# Altium schematic sheet alimentation.SchDoc: Alimentation
size A4; Date: 26.04.2023; Revision: 1; SheetNumber: 1; SheetTotal: 1
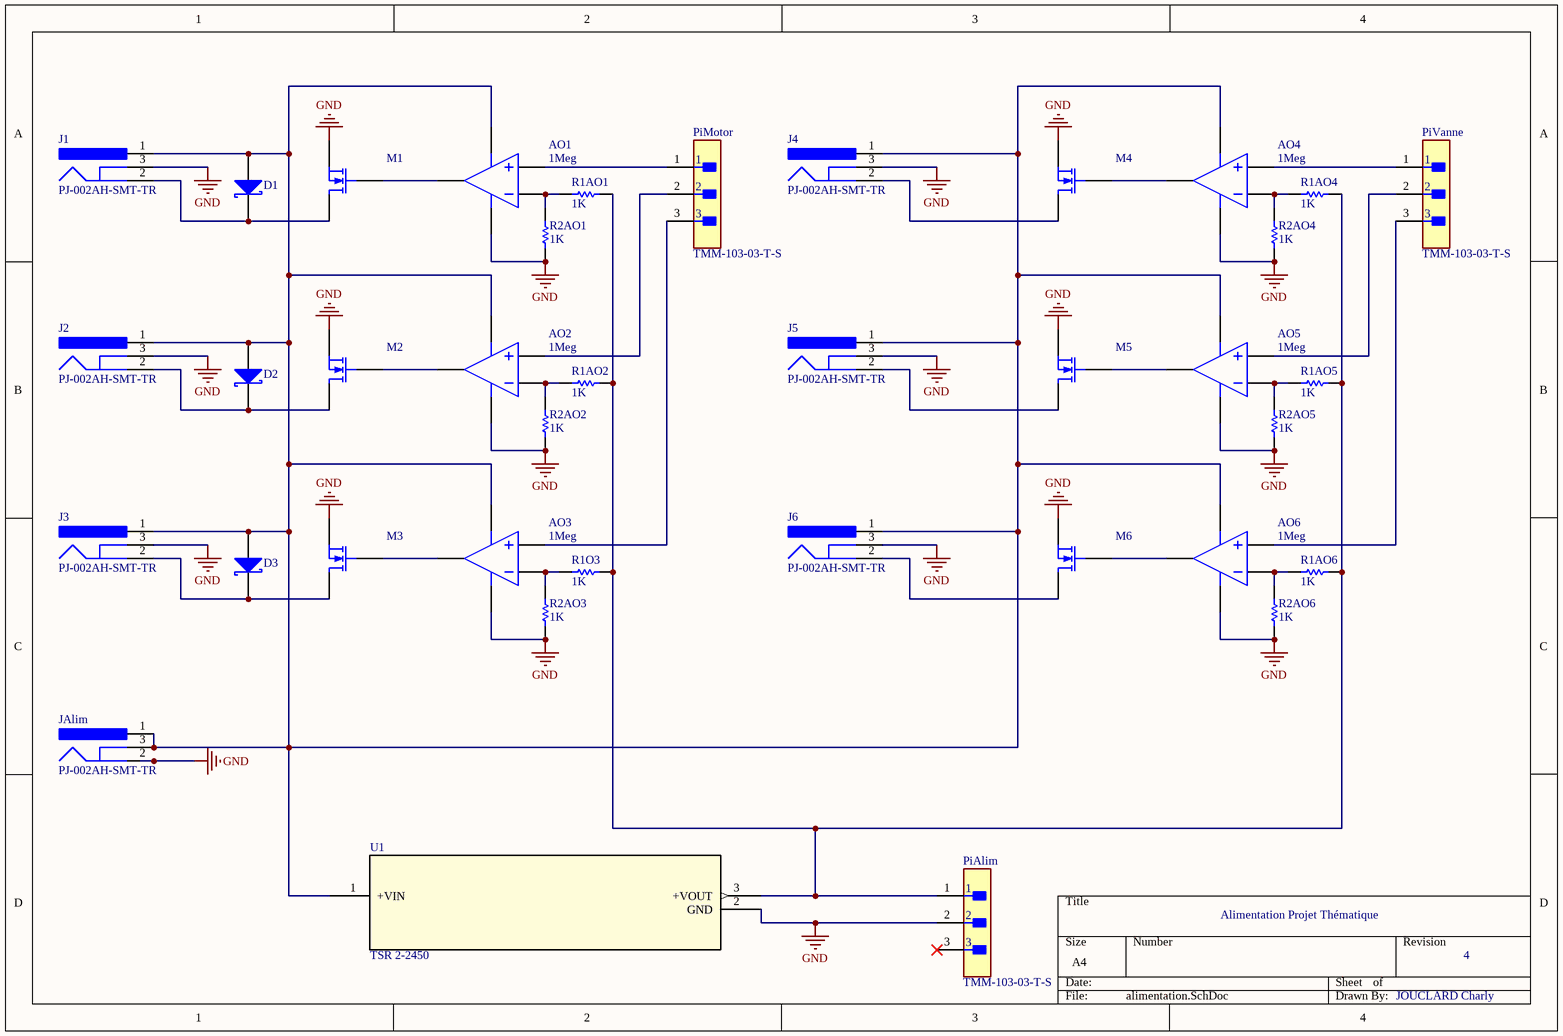
[diagram p0: alimentation.SchDoc]

## Parts
AO1  GAIN: 1Meg  (hidden comment: Ideal Operational Amplifier)
AO2  GAIN: 1Meg  (hidden comment: Ideal Operational Amplifier)
AO3  GAIN: 1Meg  (hidden comment: Ideal Operational Amplifier)
AO4  GAIN: 1Meg  (hidden comment: Ideal Operational Amplifier)
AO5  GAIN: 1Meg  (hidden comment: Ideal Operational Amplifier)
AO6  GAIN: 1Meg  (hidden comment: Ideal Operational Amplifier)
D1  Shottky Diode  (value not drawn)
D2  Shottky Diode  (value not drawn)
D3  Shottky Diode  (value not drawn)
J1  PJ-002AH-SMT-TR  [CUI-PJ-002AH-4_V]
J2  PJ-002AH-SMT-TR  [CUI-PJ-002AH-4_V]
J3  PJ-002AH-SMT-TR  [CUI-PJ-002AH-4_V]
J4  PJ-002AH-SMT-TR  [CUI-PJ-002AH-4_V]
J5  PJ-002AH-SMT-TR  [CUI-PJ-002AH-4_V]
J6  PJ-002AH-SMT-TR  [CUI-PJ-002AH-4_V]
JAlim  PJ-002AH-SMT-TR  [CUI-PJ-002AH-4_V]
M1  N-chanel Power MOSFET VDMOS Model  (value not drawn)
M2  N-chanel Power MOSFET VDMOS Model  (value not drawn)
M3  N-chanel Power MOSFET VDMOS Model  (value not drawn)
M4  N-chanel Power MOSFET VDMOS Model  (value not drawn)
M5  N-chanel Power MOSFET VDMOS Model  (value not drawn)
M6  N-chanel Power MOSFET VDMOS Model  (value not drawn)
PiAlim  TMM-103-03-T-S  [FP-TMM-103-03-T-S-MFG]
PiMotor  TMM-103-03-T-S  [FP-TMM-103-03-T-S-MFG]
PiVanne  TMM-103-03-T-S  [FP-TMM-103-03-T-S-MFG]
R1AO1  value 1K  (hidden comment: Resistor)
R1AO2  value 1K  (hidden comment: Resistor)
R1AO4  value 1K  (hidden comment: Resistor)
R1AO5  value 1K  (hidden comment: Resistor)
R1AO6  value 1K  (hidden comment: Resistor)
R1O3  value 1K  (hidden comment: Resistor)
R2AO1  value 1K  (hidden comment: Resistor)
R2AO2  value 1K  (hidden comment: Resistor)
R2AO3  value 1K  (hidden comment: Resistor)
R2AO4  value 1K  (hidden comment: Resistor)
R2AO5  value 1K  (hidden comment: Resistor)
R2AO6  value 1K  (hidden comment: Resistor)
U1  TSR 2-2450  [TSR 2-2450_TRP]

## Nets
GND: AO1.4(V+) AO2.4(V+) AO3.4(V+) AO4.4(V+) AO5.4(V+) AO6.4(V+) J1.3 J2.3 J3.3 J4.3 J5.3 J6.3 JAlim.2 M1.3(S) M2.3(S) M3.3(S) M4.3(S) M5.3(S) M6.3(S) PiAlim.2 R2AO1.1 R2AO2.1 R2AO3.1 R2AO4.1 R2AO5.1 R2AO6.1 U1.2(GND)
NetAO1_1: AO1.1(IN-) R1AO1.1 R2AO1.2
NetAO1_2: AO1.2(IN+) PiMotor.1
NetAO1_3: AO1.3(OUT) M1.2(G)
NetAO1_5: AO1.5(V-) AO2.5(V-) AO3.5(V-) AO4.5(V-) AO5.5(V-) AO6.5(V-) D1.1(A) D2.1(A) D3.1(A) J1.1 J2.1 J3.1 J4.1 J5.1 J6.1 JAlim.1 JAlim.3 U1.1(+VIN)
NetAO2_1: AO2.1(IN-) R1AO2.1 R2AO2.2
NetAO2_2: AO2.2(IN+) PiMotor.2
NetAO2_3: AO2.3(OUT) M2.2(G)
NetAO3_1: AO3.1(IN-) R1O3.1 R2AO3.2
NetAO3_2: AO3.2(IN+) PiMotor.3
NetAO3_3: AO3.3(OUT) M3.2(G)
NetAO4_1: AO4.1(IN-) R1AO4.1 R2AO4.2
NetAO4_2: AO4.2(IN+) PiVanne.1
NetAO4_3: AO4.3(OUT) M4.2(G)
NetAO5_1: AO5.1(IN-) R1AO5.1 R2AO5.2
NetAO5_2: AO5.2(IN+) PiVanne.2
NetAO5_3: AO5.3(OUT) M5.2(G)
NetAO6_1: AO6.1(IN-) R1AO6.1 R2AO6.2
NetAO6_2: AO6.2(IN+) PiVanne.3
NetAO6_3: AO6.3(OUT) M6.2(G)
NetD1_2: D1.2(K) J1.2 M1.1(D)
NetD2_2: D2.2(K) J2.2 M2.1(D)
NetD3_2: D3.2(K) J3.2 M3.1(D)
NetJ4_2: J4.2 M4.1(D)
NetJ5_2: J5.2 M5.1(D)
NetJ6_2: J6.2 M6.1(D)
NetPiAlim_1: PiAlim.1 R1AO1.2 R1AO2.2 R1AO4.2 R1AO5.2 R1AO6.2 R1O3.2 U1.3(+VOUT)

Not connected (* = marked no-connect by the designer): PiAlim 3*

## Notes on the sheet
- Alimentation Projet Thématique
- 4
- JOUCLARD Charly

## Library data of the parts
AO1-AO6 = OpAmp with power terminals: SimulationGenericComponent: True
D1-D3 = Shottky Diode: AF: 1; BV: 0; BV_MAX: 1e99; EG: 1.11; FC: 0.5; IBV: 0.001; IS: 1e-14; MJSW: 0.33; NTUN: 30; TNOM: 27; XTI: 3; SimulationGenericComponent: True; CJO: 0; CJP: 0; CTA: 0; CTP: 0; FCS: 0.5; FV_MAX: 1e99; IKF: 0; IKR: 0; ISR: 1e-14; JSW: 0; JTUN: 0; JTUNSW: 0; KEG: 1; KF: 0; LEVEL: 1; N: 1; NBV: 1; NR: 1; NS: 1; PHP: 1; RS: 0; TCV: 0; TLEV: 0; TLEVC: 0; TM1: 0; TM2: 0; TPB: 0; TPHP: 0; TRS: 0; TRS2: 0; TT: 0; TTT1: 0; TTT2: 0; VJ: 1; XTITUN: 3
J1-J6 JAlim = CMP-2000-06896-2: DC Power Jack, Right Angle, -25 to 85 degC, 4-Pin 14.8 x 9 x 11 mm SMD, RoHS, Tape and Reel; Manufacturer: CUIInc.; Brand: CUI; Inside Contact Diameter: 2mm; Voltage Rating: 24V; Insulation Resistance: 100MOhms; Outside Contact Diameter: 6.5mm; Current Rating: 5A; Mounting Angle: Right; Contact Plating: Nickel; Package Description: 4-Pin Surface Mount Device, Body 14.8 x 9 mm, Pitch 6.1 mm; Factory Pack Quantity: 350; Datasheet Version: Rev. 1.03, 11/2012; Operating Temperature Range: -25Cto+85C; Termination Style: SMD/SMT; Product: Jacks; Contact Gender: Male; Product Category: DCPowerConnectors; RoHS: True; Connector Type: DCPowerJack; Packaging: Reel; Contact Material: Brass; Flammability Rating: UL94V-0; Datasheet URL: http://www.cui.com/product/resource/pj-002ah-smt.pdf; Package Reference: PJ-002AH; Manufacturer URL: http://www.cui.com/; PartNumber: PJ-002AH; Mounting Style: SMD/SMT; Mounting Technology: SurfaceMount; Housing Material: Polyamide(PA)
M1-M6 = MOSFET N-ch VDMOS: MOSFET CSD18537NKCS; XTI: 0; A: 1; BV: 1e30; EG: 1.11; FC: 0.5; IBV: 1e-10; IS: 1e-14; PHI: 0.6; TNOM: 27; VJ: 0.8; SimulationGenericComponent: True; CGDMAX: 0; CGDMIN: 0; CGS: 0; CJO: 0; KP: 1; KSUBTHRES: 0; LAMBDA: 0; M: 0.5; MTRIODE: 1; N: 1; NBV: 1; NCHAN: 1; RB: 0; RD: 0; RDS: 1e30; RG: 0; RQ: 0; RS: 0; SUBSHIFT: 0; SUBSLOPE: 0; THETA: 0; TT: 0; VQ: 0; VTO: 0
PiAlim PiMotor PiVanne = CMP-02766-001695-1: CONN HEADER VERT 3POS 2MM; Gender: Male; Number of Positions: 3; Max Current Rating: 3.9A; Max Voltage Rating (AC): 500V; Packaging: Bulk; RoHS Compliant: Yes; Mount: Through Hole; Length: 6mm; Contact Type: Male Pin; Package Quantity: 1; Depth: 1.97mm; Contact Material: Bronze; Insulation Material: Polymer; Series: TMM; Contact Plating: Tin; Fastening Type: Pull; Housing Color: Black; Pitch: 2mm; Termination: Solder; Contact Mating Length: 0.157inch; Min Operating Temperature: -55°C; REACH SVHC: No SVHC; Orientation: Straight; Number of Rows: 1; Color: Black; Insulation Color: Black; Connector Type: Header; Radiation Hardening: No; Number of Contacts: 3; Lead Free: Lead Free; Contact Finish - Mating: TIN; Max Operating Temperature: 105°C; Housing Material: Polymer; Contact Shape: Square
R1AO1 R1AO2 R1AO4-R1AO6 R1O3 R2AO1-R2AO6 = Resistor: TC1: 0; SimulationGenericComponent: True; TC2: 0
U1 = CMP-49942-000013-2: DC DC CONVERTER 5V 10W; NexarPartId: 71799544; Min Supply Voltage: 6.5V; Max Supply Voltage: 36V; Number of Outputs: 1; Switching Frequency: 1.2MHz; Output Current: 2A; Output Voltage: 5V; Mount: Through Hole; Min Operating Temperature: -40°C; RoHS: Non-Compliant; Max Operating Temperature: 85°C; Width: 7.5mm; Output Power: 10W; Height: 10.1mm; Case/Package: SIP